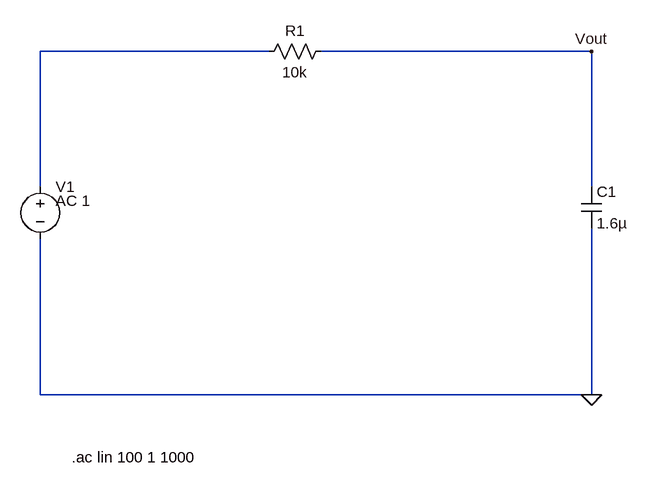
[diagram p0: schematic lpf.asc]
lpf.asc, the LTspice schematic file:
Version 4
SHEET 1 924 680
WIRE 368 -144 16 -144
WIRE 864 -144 448 -144
WIRE 16 64 16 -144
WIRE 864 64 864 -144
WIRE 16 384 16 144
WIRE 864 384 864 128
WIRE 864 384 16 384
FLAG 864 384 0
FLAG 864 -144 Vout
SYMBOL voltage 16 48 R0
WINDOW 123 24 38 Left 2
SYMATTR InstName V1
SYMATTR Value ""
SYMATTR Value2 AC 1
SYMBOL res 464 -160 R90
WINDOW 0 0 56 VBottom 2
WINDOW 3 32 56 VTop 2
SYMATTR InstName R1
SYMATTR Value 10k
SYMBOL cap 848 64 R0
SYMATTR InstName C1
SYMATTR Value 1.6µ
TEXT 64 480 Left 2 !.ac lin 100 1 1000

The netlist it stands for:
* lpf.asc
V1 N001 0 AC 1
R1 Vout N001 10k
C1 Vout 0 1.6µ
.ac lin 100 1 1000
.backanno
.end